# Altium schematic sheet MIKROBUS.SchDoc
size A4; SheetNumber: 5; SheetTotal: 6
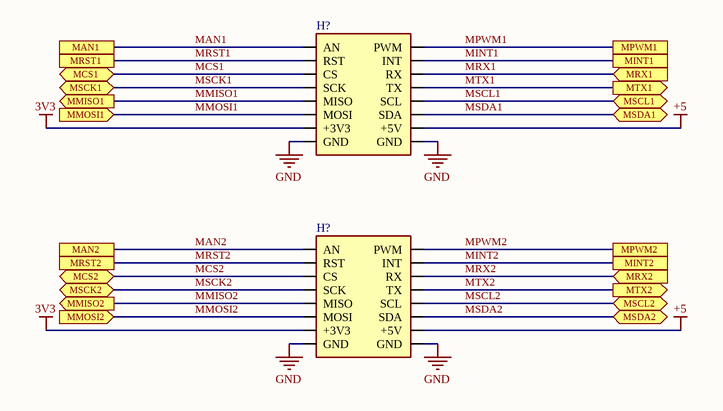
[diagram p0: MIKROBUS.SchDoc]

## Parts
(Parts that share a designator on the sheet are numbered #1, #2 ... from top to bottom, then left to right.)
H?#1  *  (value not drawn)
H?#2  *  (value not drawn)

## Ports
MAN1 (see mainSchema[3A]), MAN2 (see mainSchema[3B]), MCS1 (bidir, see mainSchema[3A]), MCS2 (bidir, see mainSchema[3B]), MINT1 (see mainSchema[3A]), MINT2 (see mainSchema[3B]), MMISO1 (out, see mainSchema[3A]), MMISO2 (out, see mainSchema[3B]), MMOSI1 (in, see mainSchema[3A]), MMOSI2 (in, see mainSchema[3B]), MPWM1 (see mainSchema[3A]), MPWM2 (see mainSchema[3B]), MRST1 (see mainSchema[3A]), MRST2 (see mainSchema[3B]), MRX1 (in, see mainSchema[3A]), MRX2 (in, see mainSchema[3B]), MSCK1 (bidir, see mainSchema[3A]), MSCK2 (bidir, see mainSchema[3B]), MSCL1 (bidir, see mainSchema[3A]), MSCL2 (bidir, see mainSchema[3B]), MSDA1 (bidir, see mainSchema[3A]), MSDA2 (bidir, see mainSchema[3B]), MTX1 (out, see mainSchema[3A]), MTX2 (out, see mainSchema[3B])

## Nets
3V3: H?#1.15(+3V3) H?#2.15(+3V3)
+5: H?#1.2(+5V) H?#2.2(+5V)
GND: H?#1.1(GND) H?#1.16(GND) H?#2.1(GND) H?#2.16(GND)
MAN1: H?#1.9(AN) ; port MAN1
MAN2: H?#2.9(AN) ; port MAN2
MCS1: H?#1.11(CS) ; port MCS1
MCS2: H?#2.11(CS) ; port MCS2
MINT1: H?#1.7(INT) ; port MINT1
MINT2: H?#2.7(INT) ; port MINT2
MMISO1: H?#1.13(MISO) ; port MMISO1
MMISO2: H?#2.13(MISO) ; port MMISO2
MMOSI1: H?#1.14(MOSI) ; port MMOSI1
MMOSI2: H?#2.14(MOSI) ; port MMOSI2
MPWM1: H?#1.8(PWM) ; port MPWM1
MPWM2: H?#2.8(PWM) ; port MPWM2
MRST1: H?#1.10(RST) ; port MRST1
MRST2: H?#2.10(RST) ; port MRST2
MRX1: H?#1.6(RX) ; port MRX1
MRX2: H?#2.6(RX) ; port MRX2
MSCK1: H?#1.12(SCK) ; port MSCK1
MSCK2: H?#2.12(SCK) ; port MSCK2
MSCL1: H?#1.4(SCL) ; port MSCL1
MSCL2: H?#2.4(SCL) ; port MSCL2
MSDA1: H?#1.3(SDA) ; port MSDA1
MSDA2: H?#2.3(SDA) ; port MSDA2
MTX1: H?#1.5(TX) ; port MTX1
MTX2: H?#2.5(TX) ; port MTX2

## Library data of the parts
H?#1 H?#2 = MIKROBUS: Value: *; HelpURL: *; MPN: *; Supplier: *; SupplierPartNumber: *